# EasyEDA schematic EasyEDA source.json
TITLE: New Schematic; REV: 1.0; Date: 2018-01-11; Sheet: 1/1; Drawn By: Your Name
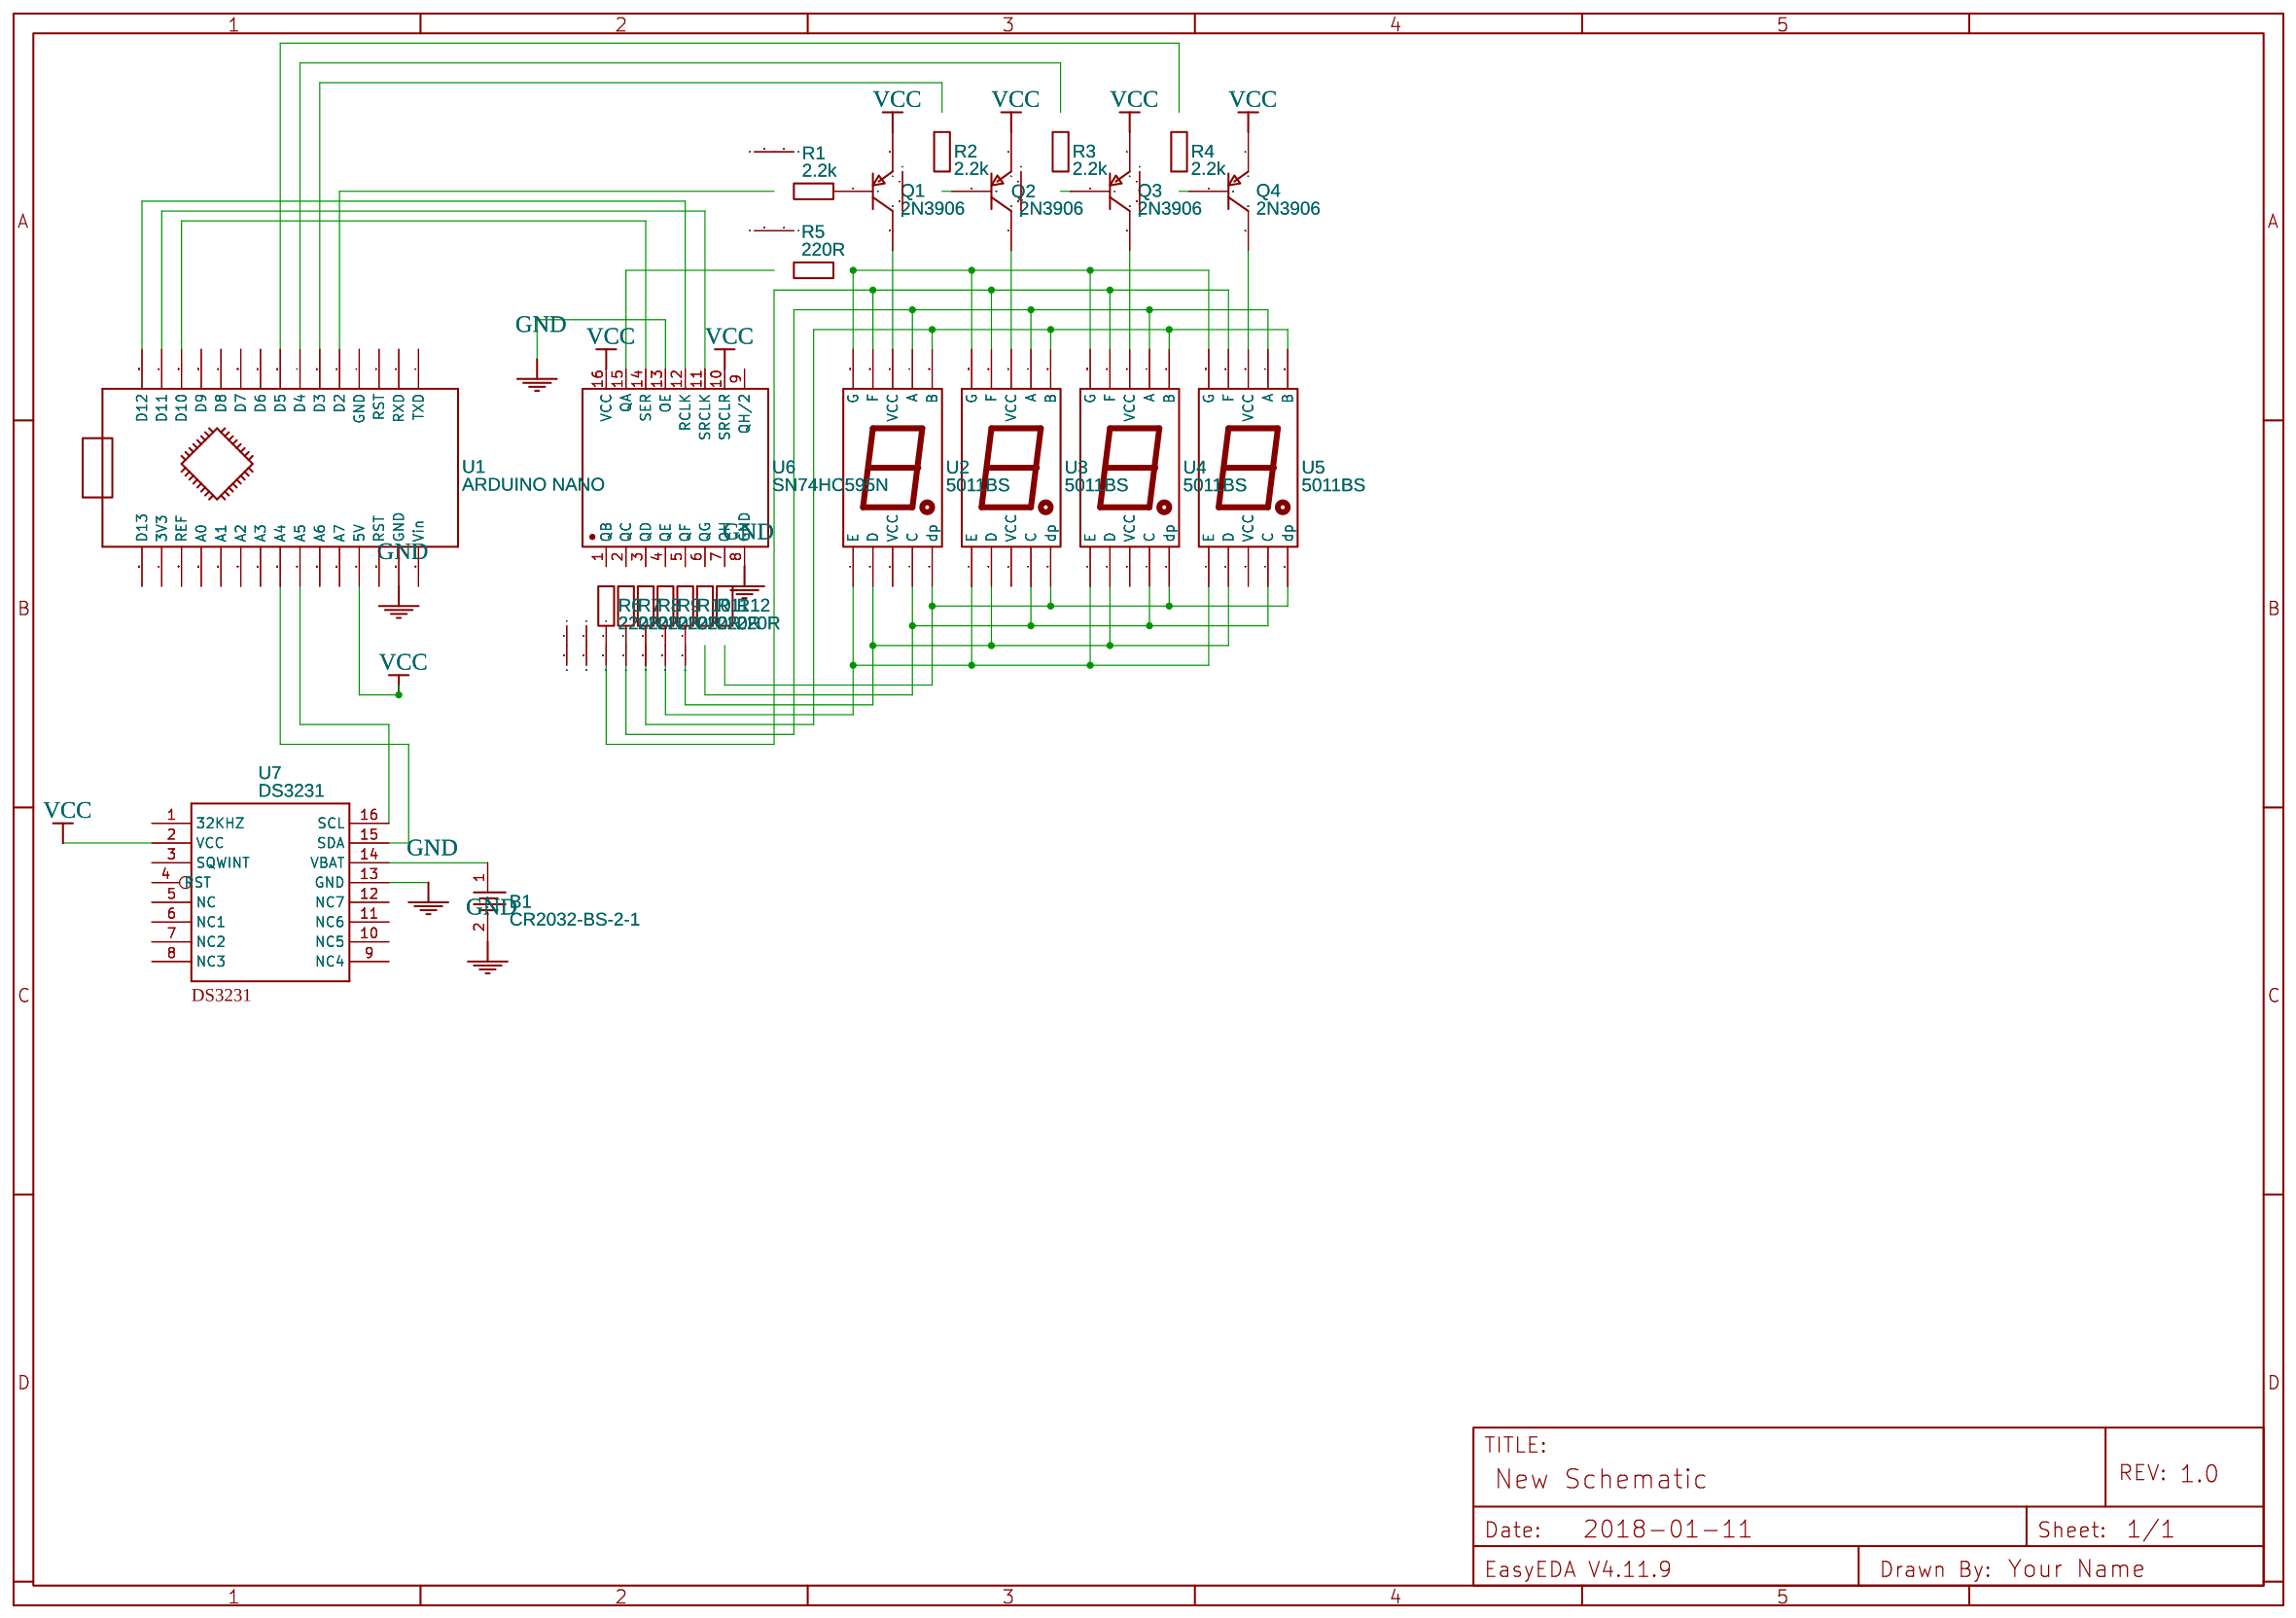
[diagram p0: schematic sheet]

## Parts
B1  CR2032-BS-2-1  [BATTERY-1]
Q1  2N3906  [TO-92A]
Q2  2N3906  [TO-92A]
Q3  2N3906  [TO-92A]
Q4  2N3906  [TO-92A]
R1  2.2k  [AXIAL-0.4]
R2  2.2k  [AXIAL-0.4]
R3  2.2k  [AXIAL-0.4]
R4  2.2k  [AXIAL-0.4]
R5  220R  [1206]
R6  220R  [1206]
R7  220R  [1206]
R8  220R  [1206]
R9  220R  [1206]
R10  220R  [1206]
R11  220R  [1206]
R12  220R  [1206]
U1  ARDUINO NANO  [ARDUINO_NANO]
U2  5011BS  [5011BS]
U3  5011BS  [5011BS]
U4  5011BS  [5011BS]
U5  5011BS  [5011BS]
U6  SN74HC595N  [DIP16]
U7  DS3231  [SO16W]

## Library data of the parts
B1 = -: Supplier: LCSC; Manufacturer: Q&J; Manufacturer Part: BS-2-1; LCSC: C70376
Q1-Q4 = -: PNP General Purpose Amplifier; catid: 20; Manufacturer Part: ?
R1-R12 = Resistor: Manufacturer Part: ?
U1 = -: catid: 20; sourceId: g2wyehQ7j; Manufacturer Part: ?
U2-U5 = -: Contributor: Zadris
U6 = -: Manufacturer Part: ?
U7 = -: catid: 20; Contributor: Adafruit; Manufacturer Part: ?

## Nets
GND: B1.2 U1.29(GND) U6.8(GND) U6.13(OE) U7.13(GND)
VCC: Q1.1(E) Q2.1(E) Q3.1(E) Q4.1(E) U1.27(5V) U6.10(SRCLR) U6.16(VCC) U7.2(VCC)
Net-(B1-1): B1.1 U7.14(VBAT)
Net-(Q1-3): Q1.3(C) U2.3(VCC)
Net-(Q2-2): Q2.2(B) R2.1
Net-(Q2-3): Q2.3(C) U3.3(VCC)
Net-(Q3-2): Q3.2(B) R3.1
Net-(Q3-3): Q3.3(C) U4.3(VCC)
Net-(Q4-2): Q4.2(B) R4.1
Net-(Q4-3): Q4.3(C) U5.3(VCC)
Net-(R1-1): R1.1 U1.5(D2)
Net-(R2-2): R2.2 U1.6(D3)
Net-(R3-2): R3.2 U1.7(D4)
Net-(R4-2): R4.2 U1.8(D5)
Net-(R5-1): R5.1 U6.15(QA)
Net-(R5-2): R5.2 U2.10(G) U3.10(G) U4.10(G) U5.10(G)
Net-(R6-1): R6.1 U2.9(F) U3.9(F) U4.9(F) U5.9(F)
Net-(R6-2): R6.2 U6.1(QB)
Net-(R7-1): R7.1 U2.7(A) U3.7(A) U4.7(A) U5.7(A)
Net-(R7-2): R7.2 U6.2(QC)
Net-(R8-1): R8.1 U2.6(B) U3.6(B) U4.6(B) U5.6(B)
Net-(R8-2): R8.2 U6.3(QD)
Net-(R9-1): R9.1 U2.1(E) U3.1(E) U4.1(E) U5.1(E)
Net-(R9-2): R9.2 U6.4(QE)
Net-(R10-1): R10.1 U2.2(D) U3.2(D) U4.2(D) U5.2(D)
Net-(R10-2): R10.2 U6.5(QF)
Net-(R11-1): R11.1 U2.4(C) U3.4(C) U4.4(C) U5.4(C)
Net-(R11-2): R11.2 U6.6(QG)
Net-(R12-1): R12.1 U2.5(dp) U3.5(dp) U4.5(dp) U5.5(dp)
Net-(R12-2): R12.2 U6.7(QH)
Net-(U1-13): U1.13(D10) U6.14(SER)
Net-(U1-14): U1.14(D11) U6.11(SRCLK)
Net-(U1-15): U1.15(D12) U6.12(RCLK)
Net-(U1-23): U1.23(A4) U7.15(SDA)
Net-(U1-24): U1.24(A5) U7.16(SCL)

Not connected (* = marked no-connect by the designer): Q1 2(B); R1 2; U1 1(TXD) 2(RXD) 3(RST) 4(GND) 9(D6) 10(D7) 11(D8) 12(D9) 16(D13) 17(3V3) 18(REF) 19(A0) 20(A1) 21(A2) 22(A3) 25(A6) 26(A7) 28(RST) 30(Vin); U6 9(QH/2); U7 1(32KHZ) 3(SQWINT) 4(RST) 5(NC) 6(NC1) 7(NC2) 8(NC3) 9(NC4) 10(NC5) 11(NC6) 12(NC7)
